# Altium schematic sheet tr_auxiliary.SchDoc
size A
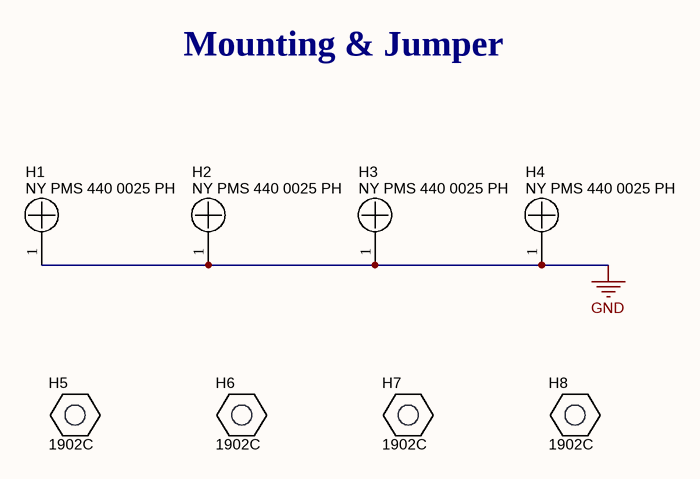
[diagram p0: tr_auxiliary.SchDoc]

## Parts
H1  NY PMS 440 0025 PH  [NY PMS 440 0025 PH]
H2  NY PMS 440 0025 PH  [NY PMS 440 0025 PH]
H3  NY PMS 440 0025 PH  [NY PMS 440 0025 PH]
H4  NY PMS 440 0025 PH  [NY PMS 440 0025 PH]
H5  1902C  [Keystone_1902C]
H6  1902C  [Keystone_1902C]
H7  1902C  [Keystone_1902C]
H8  1902C  [Keystone_1902C]

## Nets
GND: H1.1 H2.1 H3.1 H4.1

## Notes on the sheet
- Mounting & Jumper

## Library data of the parts
H1-H4 = NY PMS 440 0025 PH: Machine Screw, Round, #4-40 x 1/4, Nylon, Philips panhead; Manufacturer: B&F Fastener Supply; CompType: Hardware; SymbolCreator: codlsc; U/M: EA; SymbolVersion: 2009-10-28; MountType: N/A; RoHS: Y; PartNumber: NY PMS 440 0025 PH; PackageReference: Screw; DigiKeyPartNumber: H542-ND; ComponentLink1Description: Datasheet Link; ComponentLink1URL: http://www.fasnetdirect.com/refguide/Nylpanms.pdf; ClassName: Mounting Holes; LatestRevisionDate: 2015-08-27; Publisher: Texas Instruments; Supplier 1: Digi-Key; Supplier Part Number 1: H542-ND
H5-H8 = 1902C: Standoff, Hex, 0.5"L #4-40 Nylon; Manufacturer: Keystone; CompType: Hardware; SymbolCreator: a0412235; MountType: N/A; RoHS: Y; PartNumber: 1902C; PackageReference: Standoff; ComponentLink1Description: Datasheet Link; ComponentLink1URL: http://www.keyelco.com/pdfs/M55-prod31.pdf; LatestRevisionDate: 2015-08-27; Publisher: Texas Instruments; Supplier 1: Digi-Key; Supplier Part Number 1: 36-1902C-ND; SymbolVersion: 2013-06-24